# EasyEDA schematic SmartHome.json

## Sheets
1 StudyRoom_AllAnalog: TITLE: Sheet_1; REV: 1.0; Date: 2026-07-09; Sheet: 1/1; Drawn By: Ananthapadmanaban gururajan; Company: Your Company
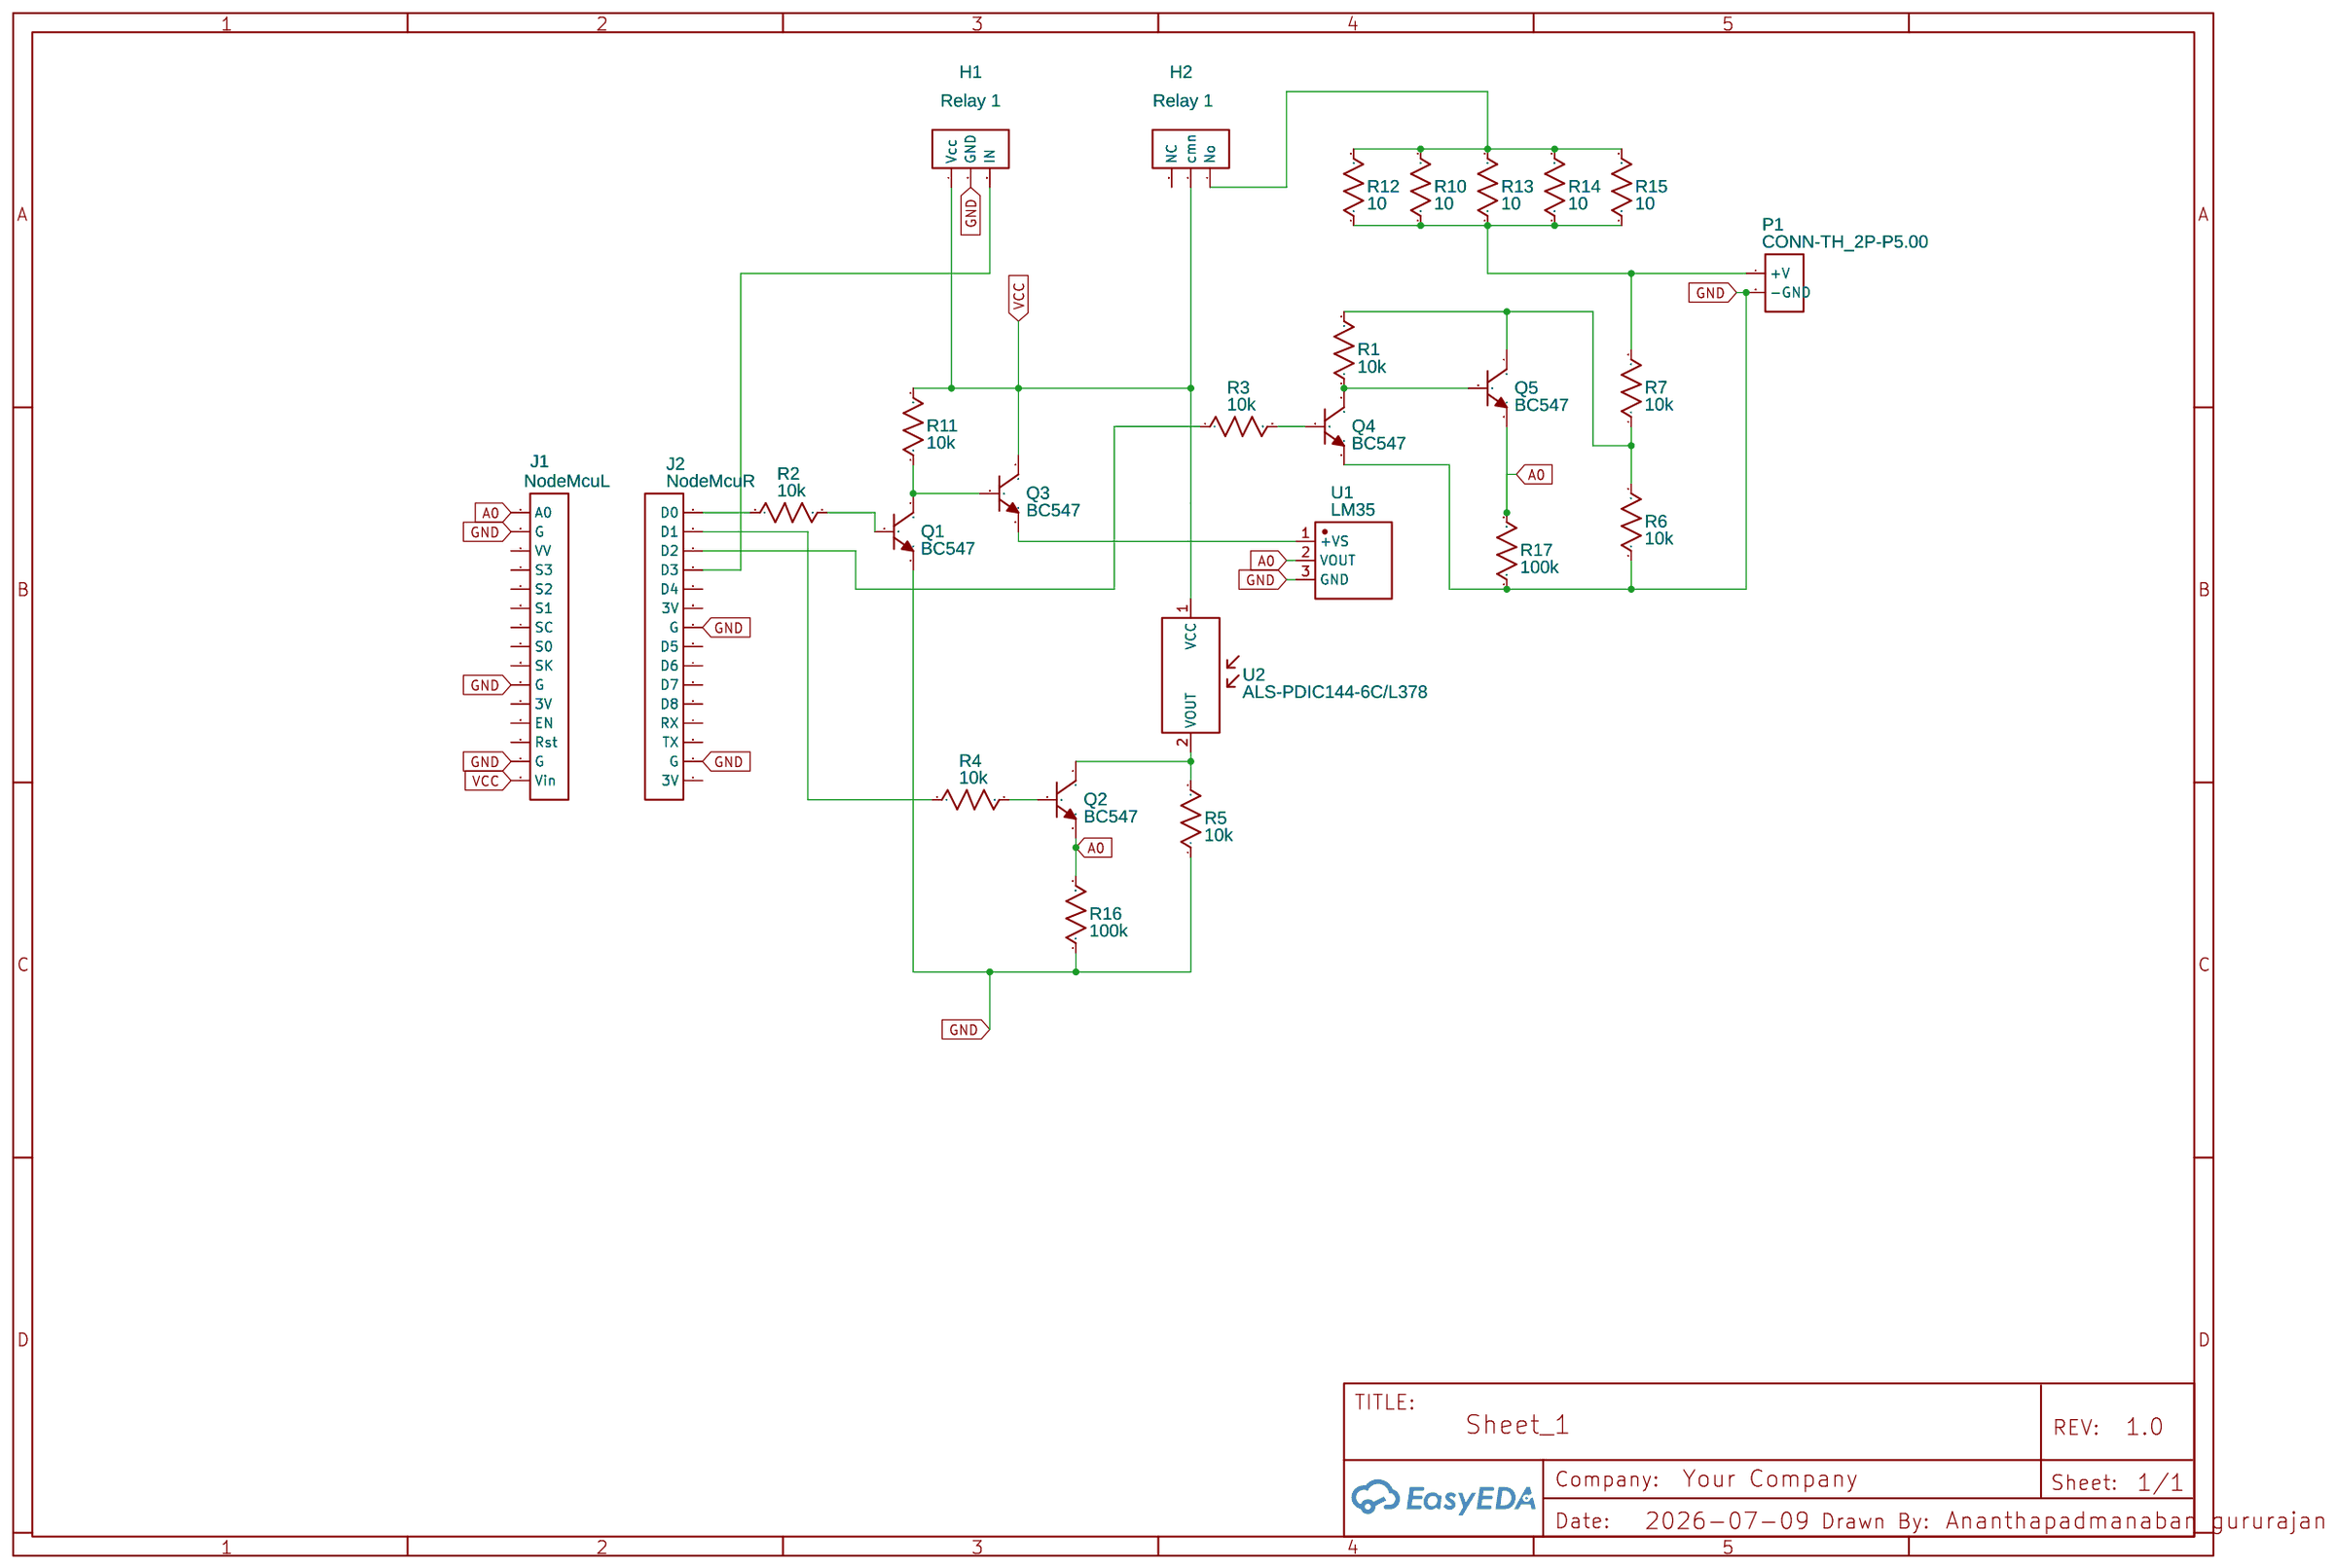
[diagram p0: StudyRoom_AllAnalog]
2 StudyRoom: Date: 2026-07-19
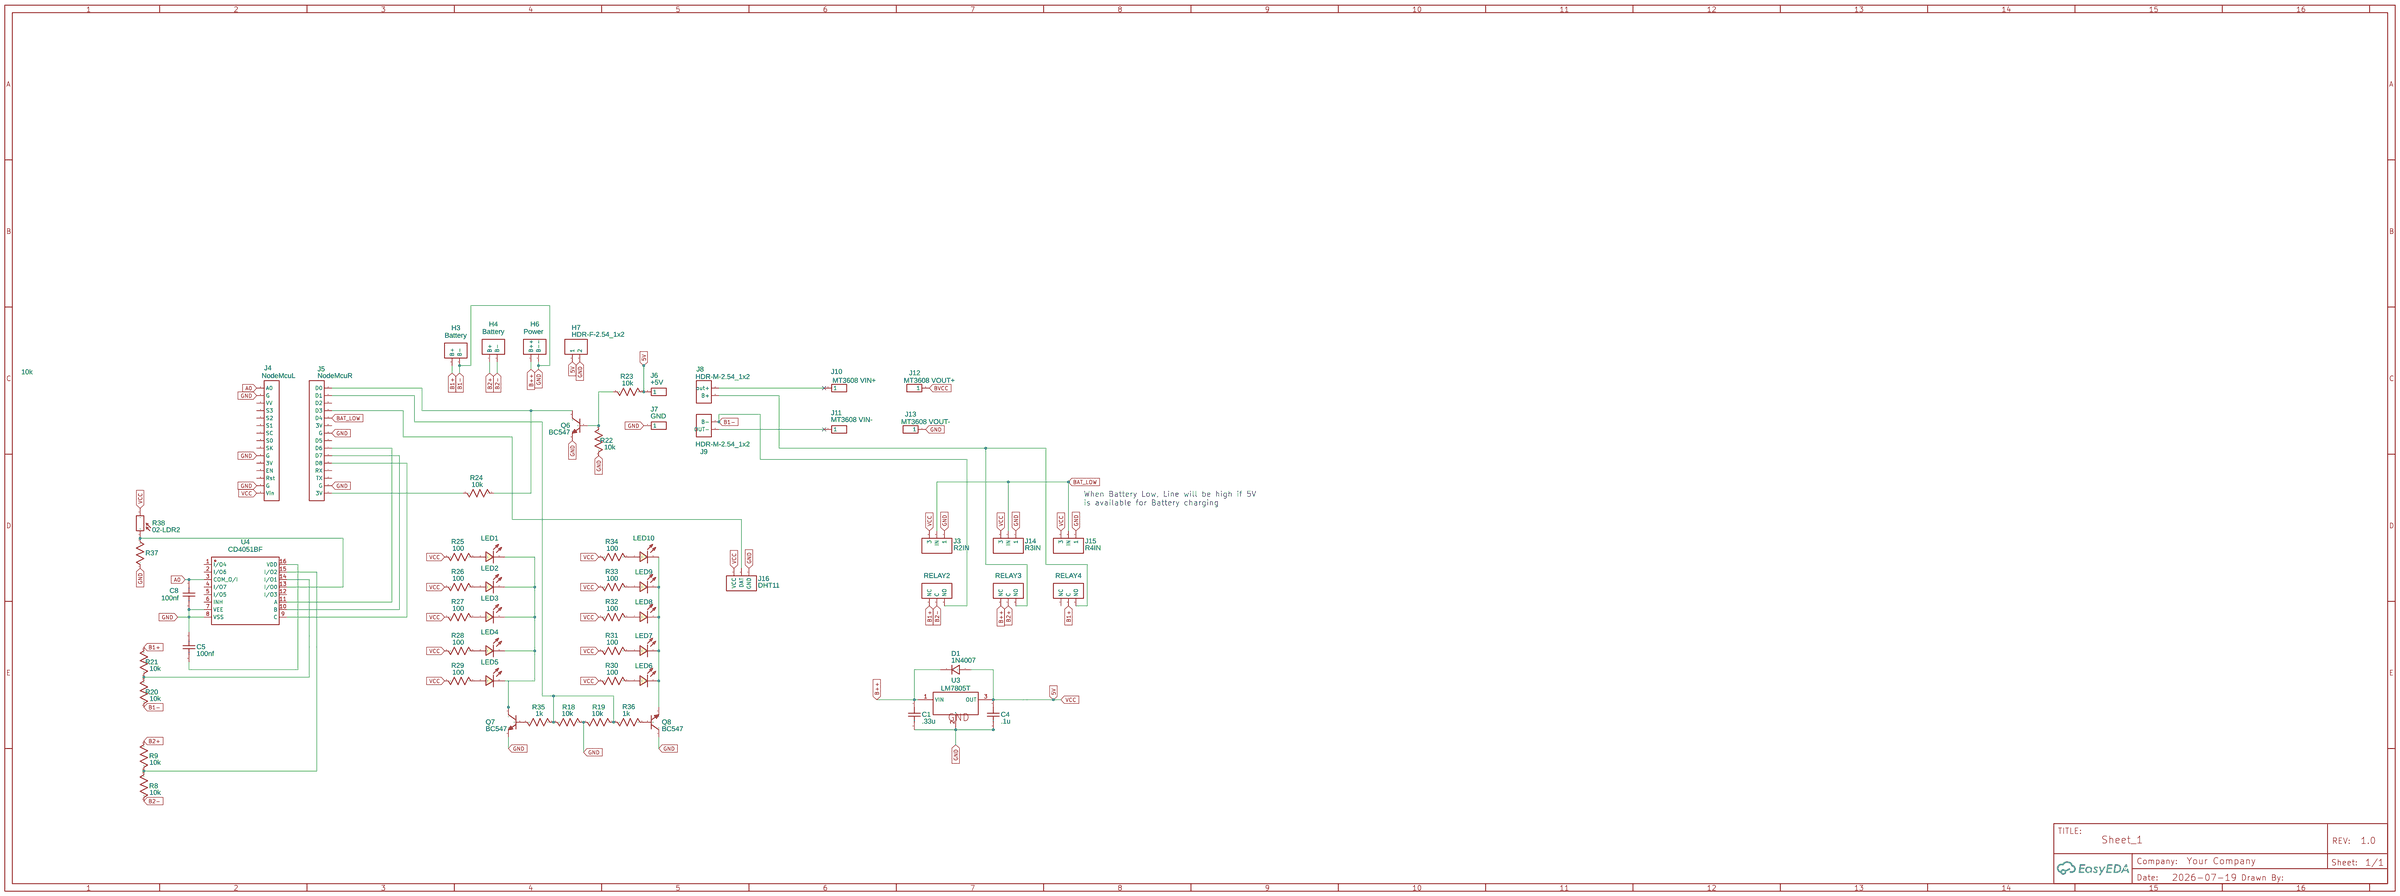
[diagram p1: StudyRoom]

## Parts
sheet StudyRoom
C1  .33u  [RAD-0.1]
C4  .1u  [RAD-0.1]
C5  100nf  [RAD-0.1]
C8  100nf  [RAD-0.1]
D1  1N4007  [DO-41_BD2.4-L4.7-P8.70-D0.9-RD]
H3  Battery  [HDR-F-2.54_1X2]
H4  Battery  [HDR-F-2.54_1X2]
H6  Power  [HDR-F-2.54_1X2]
H7  HDR-F-2.54_1x2  [HDR-F-2.54_1X2]
J3  R2IN  [HDR-M-2.54_1X3]
J4  NodeMcuL  [HDR-M-2.54_1X15]
J5  NodeMcuR  [HDR-M-2.54_1X15]
J6  +5V  [HDR-M-2.54_1X1]
J7  GND  [HDR-M-2.54_1X1]
J8  HDR-M-2.54_1x2  [HDR-M-2.54_1X2]
J9  HDR-M-2.54_1x2  [HDR-M-2.54_1X2]
J10  MT3608 VIN+  [HDR-M-2.54_1X1]
J11  MT3608 VIN-  [HDR-M-2.54_1X1]
J12  MT3608 VOUT+  [HDR-M-2.54_1X1]
J13  MT3608 VOUT-  [HDR-M-2.54_1X1]
J14  R3IN  [HDR-M-2.54_1X3]
J15  R4IN  [HDR-M-2.54_1X3]
J16  DHT11  [HDR-M-2.54_1X3]
LED1  LED-TH-3mm_R  [LED-TH_BD3.0_RED]
LED2  LED-TH-3mm_R  [LED-TH_BD3.0_RED]
LED3  LED-TH-3mm_R  [LED-TH_BD3.0_RED]
LED4  LED-TH-3mm_R  [LED-TH_BD3.0_RED]
LED5  LED-TH-3mm_R  [LED-TH_BD3.0_RED]
LED6  LED-TH-3mm_R  [LED-TH_BD3.0_RED]
LED7  LED-TH-3mm_R  [LED-TH_BD3.0_RED]
LED8  LED-TH-3mm_R  [LED-TH_BD3.0_RED]
LED9  LED-TH-3mm_R  [LED-TH_BD3.0_RED]
LED10  LED-TH-3mm_R  [LED-TH_BD3.0_RED]
Q6  BC547  [TO-92-3_L4.5-W3.5-P1.27-L]
Q7  BC547  [TO-92-3_L4.5-W3.5-P1.27-L]
Q8  BC547  [TO-92-3_L4.5-W3.5-P1.27-L]
R8  10k  [R_AXIAL-0.3]
R9  10k  [R_AXIAL-0.3]
R18  10k  [R_AXIAL-0.3]
R19  10k  [R_AXIAL-0.3]
R20  10k  [R_AXIAL-0.3]
R21  10k  [R_AXIAL-0.3]
R22  10k  [R_AXIAL-0.3]
R23  10k  [R_AXIAL-0.3]
R24  10k  [R_AXIAL-0.3]
R25  100  [R_AXIAL-0.3]
R26  100  [R_AXIAL-0.3]
R27  100  [R_AXIAL-0.3]
R28  100  [R_AXIAL-0.3]
R29  100  [R_AXIAL-0.3]
R30  100  [R_AXIAL-0.3]
R31  100  [R_AXIAL-0.3]
R32  100  [R_AXIAL-0.3]
R33  100  [R_AXIAL-0.3]
R34  100  [R_AXIAL-0.3]
R35  1k  [R_AXIAL-0.3]
R36  1k  [R_AXIAL-0.3]
R37  10k  [R_AXIAL-0.3]
R38  02-LDR2  [RES-TH_L5.0-W4.3-P3.40-D0.5]
RELAY2  Relay1  [HDR-M-2.54_1X3]
RELAY3  Relay1  [HDR-M-2.54_1X3]
RELAY4  Relay1  [HDR-M-2.54_1X3]
U3  LM7805T  [TO-220-3_L10.0-W4.5-P2.54-L]
U4  CD4051BF  [PDIP-16_L19.3-W6.4-P2.54-LS7.94-BL]
sheet StudyRoom_AllAnalog
H1  Relay 1  [HDR-F-2.54_1X3]
H2  Relay 1  [HDR-F-2.54_1X3]
J1  NodeMcuL  [HDR-M-2.54_1X15]
J2  NodeMcuR  [HDR-M-2.54_1X15]
P1  CONN-TH_2P-P5.00  [CONN-TH_2P-P5.00]
Q1  BC547  [TO-92-3_L4.5-W3.5-P1.27-L]
Q2  BC547  [TO-92-3_L4.5-W3.5-P1.27-L]
Q3  BC547  [TO-92-3_L4.5-W3.5-P1.27-L]
Q4  BC547  [TO-92-3_L4.5-W3.5-P1.27-L]
Q5  BC547  [TO-92-3_L4.5-W3.5-P1.27-L]
R1  10k  [R_AXIAL-0.3]
R2  10k  [R_AXIAL-0.3]
R3  10k  [R_AXIAL-0.3]
R4  10k  [R_AXIAL-0.3]
R5  10k  [R_AXIAL-0.3]
R6  10k  [R_AXIAL-0.3]
R7  10k  [R_AXIAL-0.3]
R10  10  [R_AXIAL-0.3]
R11  10k  [R_AXIAL-0.3]
R12  10  [R_AXIAL-0.3]
R13  10  [R_AXIAL-0.3]
R14  10  [R_AXIAL-0.3]
R15  10  [R_AXIAL-0.3]
R16  100k  [R_AXIAL-0.3]
R17  100k  [R_AXIAL-0.3]
U1  LM35  [TO-92-3_L4.8-W3.7-P1.27-L]
U2  ALS-PDIC144-6C/L378  [SENSORM-TH_EVERLIGHT_ALS-PDIC144-6C--L378]

## Library data of the parts
C1 C4 C5 C8 = C_RAD-0.1_US: Contributor: LCEDA_Lib
D1 = 1N4007: Supplier: LCSC; Manufacturer: SEMTECH; Supplier Part: C106903; Contributor: LCEDA_Lib
H3 H4 H6 H7 = HDR-F-2.54_1x2: Supplier Part: C49661; Supplier: LCSC; Contributor: LCEDA_Lib
J3 J14-J16 RELAY2-RELAY4 = HDR-M-2.54_1x3: Supplier Part: C180248; Supplier: LCSC; Contributor: LCEDA_Lib
J1 J2 J4 J5 = HDR-M-2.54_1x15: Supplier Part: C124373; Supplier: LCSC; Contributor: LCEDA_Lib
J6 J7 J10-J13 = HDR-M-2.54_1x1: Supplier Part: C81276; Supplier: LCSC; Contributor: LCEDA_Lib
J8 J9 = HDR-M-2.54_1x2: Supplier Part: C124375; Supplier: LCSC; Contributor: LCEDA_Lib
LED1-LED10 = LED-TH-3mm_R: Manufacturer: EVERLIGHT(台湾亿光); Manufacturer Part: 204-10SDRD/S530-A3-L; Supplier Part: C84774; Supplier: LCSC; Contributor: LCEDA_Lib
Q1-Q8 = BC547: Contributor: LCSC; Supplier: LCSC; Supplier Part: C2910381; Manufacturer: CJ(江苏长电/长晶); Manufacturer Part: BC547(RANGE:420-800); JLCPCB Part Class: Extended Part
R1-R37 = R_AXIAL-0.3_US: Contributor: LCEDA_Lib
R38 = 02-LDR2: Supplier: LCSC; Supplier Part: C17271554; Manufacturer: NTE Electronics; JLCPCB Part Class: Extended Part; Contributor: lcsc
U3 = LM7805T: Contributor: LCSC; Supplier: LCSC; Supplier Part: C507145; Manufacturer: HGC(华冠); JLCPCB Part Class: Extended Part
U4 = CD4051BF: Contributor: lcsc; Supplier: LCSC; Supplier Part: C3657417; Manufacturer: TI(德州仪器); JLCPCB Part Class: Extended Part
H1 H2 = HDR-F-2.54_1x3: Supplier Part: C146690; Supplier: LCSC; Contributor: LCEDA_Lib
P1 = CONN-TH_2P-P5.00: Supplier: LCSC; Contributor: LCEDA_Lib
U1 = LM35: Supplier: LCSC; Supplier Part: C49196609; Manufacturer: Silicore(芯谷); JLCPCB Part Class: Extended Part; Contributor: lcsc
U2 = ALS-PDIC144-6C/L378: Contributor: LCSC; Supplier: LCSC; Supplier Part: C2943463; Manufacturer: EVERLIGHT(亿光); JLCPCB Part Class: Extended Part

## Nets
5V: C4.1 D1.2 H1.1(Vcc) H2.2(cmn) H7.1 J1.15(Vin) J3.3 J4.15(Vin) J6.1 J14.3 J15.3 J16.3(VCC) Q3.1(C) R11.2 R23.1 R25.2 R26.2 R27.2 R28.2 R29.2 R30.2 R31.2 R32.2 R33.2 R34.2 R38.1 U2.1(VCC) U3.3(OUT)
A0: C8.1 J1.1(A0) J4.1(A0) Q2.3(E) Q5.3(E) R16.2 R17.2 U1.2(VOUT) U4.3(COM_O/I)
B1+: H3.1(B+) R21.1 RELAY2.1(NC) RELAY4.2(C)
B1-: C1.2 C4.2 C5.1 C8.2 H1.2(GND) H3.2(B-) H6.2(B--) H7.2 J1.2(G) J1.10(G) J1.14(G) J2.2(G) J2.9(G) J3.1 J4.2(G) J4.10(G) J4.14(G) J5.2(G) J5.9(G) J7.1 J9.2(B-) J13.1 J14.1 J15.1 J16.1(GND) P1.2(-GND) Q1.3(E) Q4.3(E) Q6.3(E) Q7.3(E) Q8.1(C) R5.1 R6.1 R16.1 R17.1 R18.1 R19.2 R20.2 R22.2 R37.1 RELAY2.3(NO) U1.3(GND) U3.2(GND) U4.7(VEE) U4.8(VSS)
B2+: H4.1(B+) R9.1 RELAY3.2(C)
B2-: H4.2(B-) R8.2 RELAY2.2(C)
B++: C1.1 D1.1 H6.1(B++) RELAY3.1(NC) U3.1(VIN)
BAT_LOW: J3.2(IN) J5.11(D4) J14.2(IN) J15.2(IN)
BVCC: J12.1
Net-(C5-2): C5.2 U4.16(VDD)
Net-(H1-3): H1.3(IN) J2.12(D3)
Net-(H2-1): H2.1(No) R10.2 R12.2 R13.2 R14.2 R15.2
Net-(J2-13): J2.13(D2) R3.1
Net-(J2-14): J2.14(D1) R4.1
Net-(J2-15): J2.15(D0) R2.1
Net-(J5-1): J5.1(3V) R24.2
Net-(J5-5): J5.5(D8) U4.9(C)
Net-(J5-6): J5.6(D7) U4.10(B)
Net-(J5-7): J5.7(D6) U4.11(A)
Net-(J5-12): J5.12(D3) J16.2(DAT)
Net-(J5-14): J5.14(D1) R18.2 R19.1 R35.1 R36.1
Net-(J5-15): J5.15(D0) Q6.1(C) R24.1
Net-(J8-1): J8.1(B+) RELAY3.3(NO) RELAY4.3(NO)
Net-(J8-2): J8.2(out+) J10.1
Net-(J9-1): J9.1(OUT-) J11.1
Net-(LED1-1): LED1.1 R25.1
Net-(LED1-2): LED1.2 LED2.2 LED3.2 LED4.2 LED5.2 Q7.1(C)
Net-(LED2-1): LED2.1 R26.1
Net-(LED3-1): LED3.1 R27.1
Net-(LED4-1): LED4.1 R28.1
Net-(LED5-1): LED5.1 R29.1
Net-(LED6-1): LED6.1 R30.1
Net-(LED6-2): LED6.2 LED7.2 LED8.2 LED9.2 LED10.2 Q8.3(E)
Net-(LED7-1): LED7.1 R31.1
Net-(LED8-1): LED8.1 R32.1
Net-(LED9-1): LED9.1 R33.1
Net-(LED10-1): LED10.1 R34.1
Net-(P1-1): P1.1(+V) R7.2 R10.1 R12.1 R13.1 R14.1 R15.1
Net-(Q1-1): Q1.1(C) Q3.2(B) R11.1
Net-(Q1-2): Q1.2(B) R2.2
Net-(Q2-1): Q2.1(C) R5.2 U2.2(VOUT)
Net-(Q2-2): Q2.2(B) R4.2
Net-(Q3-3): Q3.3(E) U1.1(+VS)
Net-(Q4-1): Q4.1(C) Q5.2(B) R1.1
Net-(Q4-2): Q4.2(B) R3.2
Net-(Q5-1): Q5.1(C) R1.2 R6.2 R7.1
Net-(Q6-2): Q6.2(B) R22.1 R23.2
Net-(Q7-2): Q7.2(B) R35.2
Net-(Q8-2): Q8.2(B) R36.2
Net-(R8-1): R8.1 R9.2 U4.15(I/O2)
Net-(R20-1): R20.1 R21.2 U4.14(I/O1)
Net-(R37-2): R37.2 R38.2 U4.13(I/O0)

Not connected (* = marked no-connect by the designer): H2 3(NC); J1 3(VV) 4(S3) 5(S2) 6(S1) 7(SC) 8(S0) 9(SK) 11(3V) 12(EN) 13(Rst); J2 1(3V) 3(TX) 4(RX) 5(D8) 6(D7) 7(D6) 8(D5) 10(3V) 11(D4); J4 3(VV) 4(S3) 5(S2) 6(S1) 7(SC) 8(S0) 9(SK) 11(3V) 12(EN) 13(Rst); J5 3(TX) 4(RX) 8(D5) 10(3V) 13(D2); RELAY4 1(NC); U4 1(I/O4) 2(I/O6) 4(I/O7) 5(I/O5) 6(INH) 12(I/O3)

## Notes on the sheets
sheet 2
- When Battery Low, Line will be high if 5V
  is available for Battery charging
